# Altium project controlhub.PrjPCB
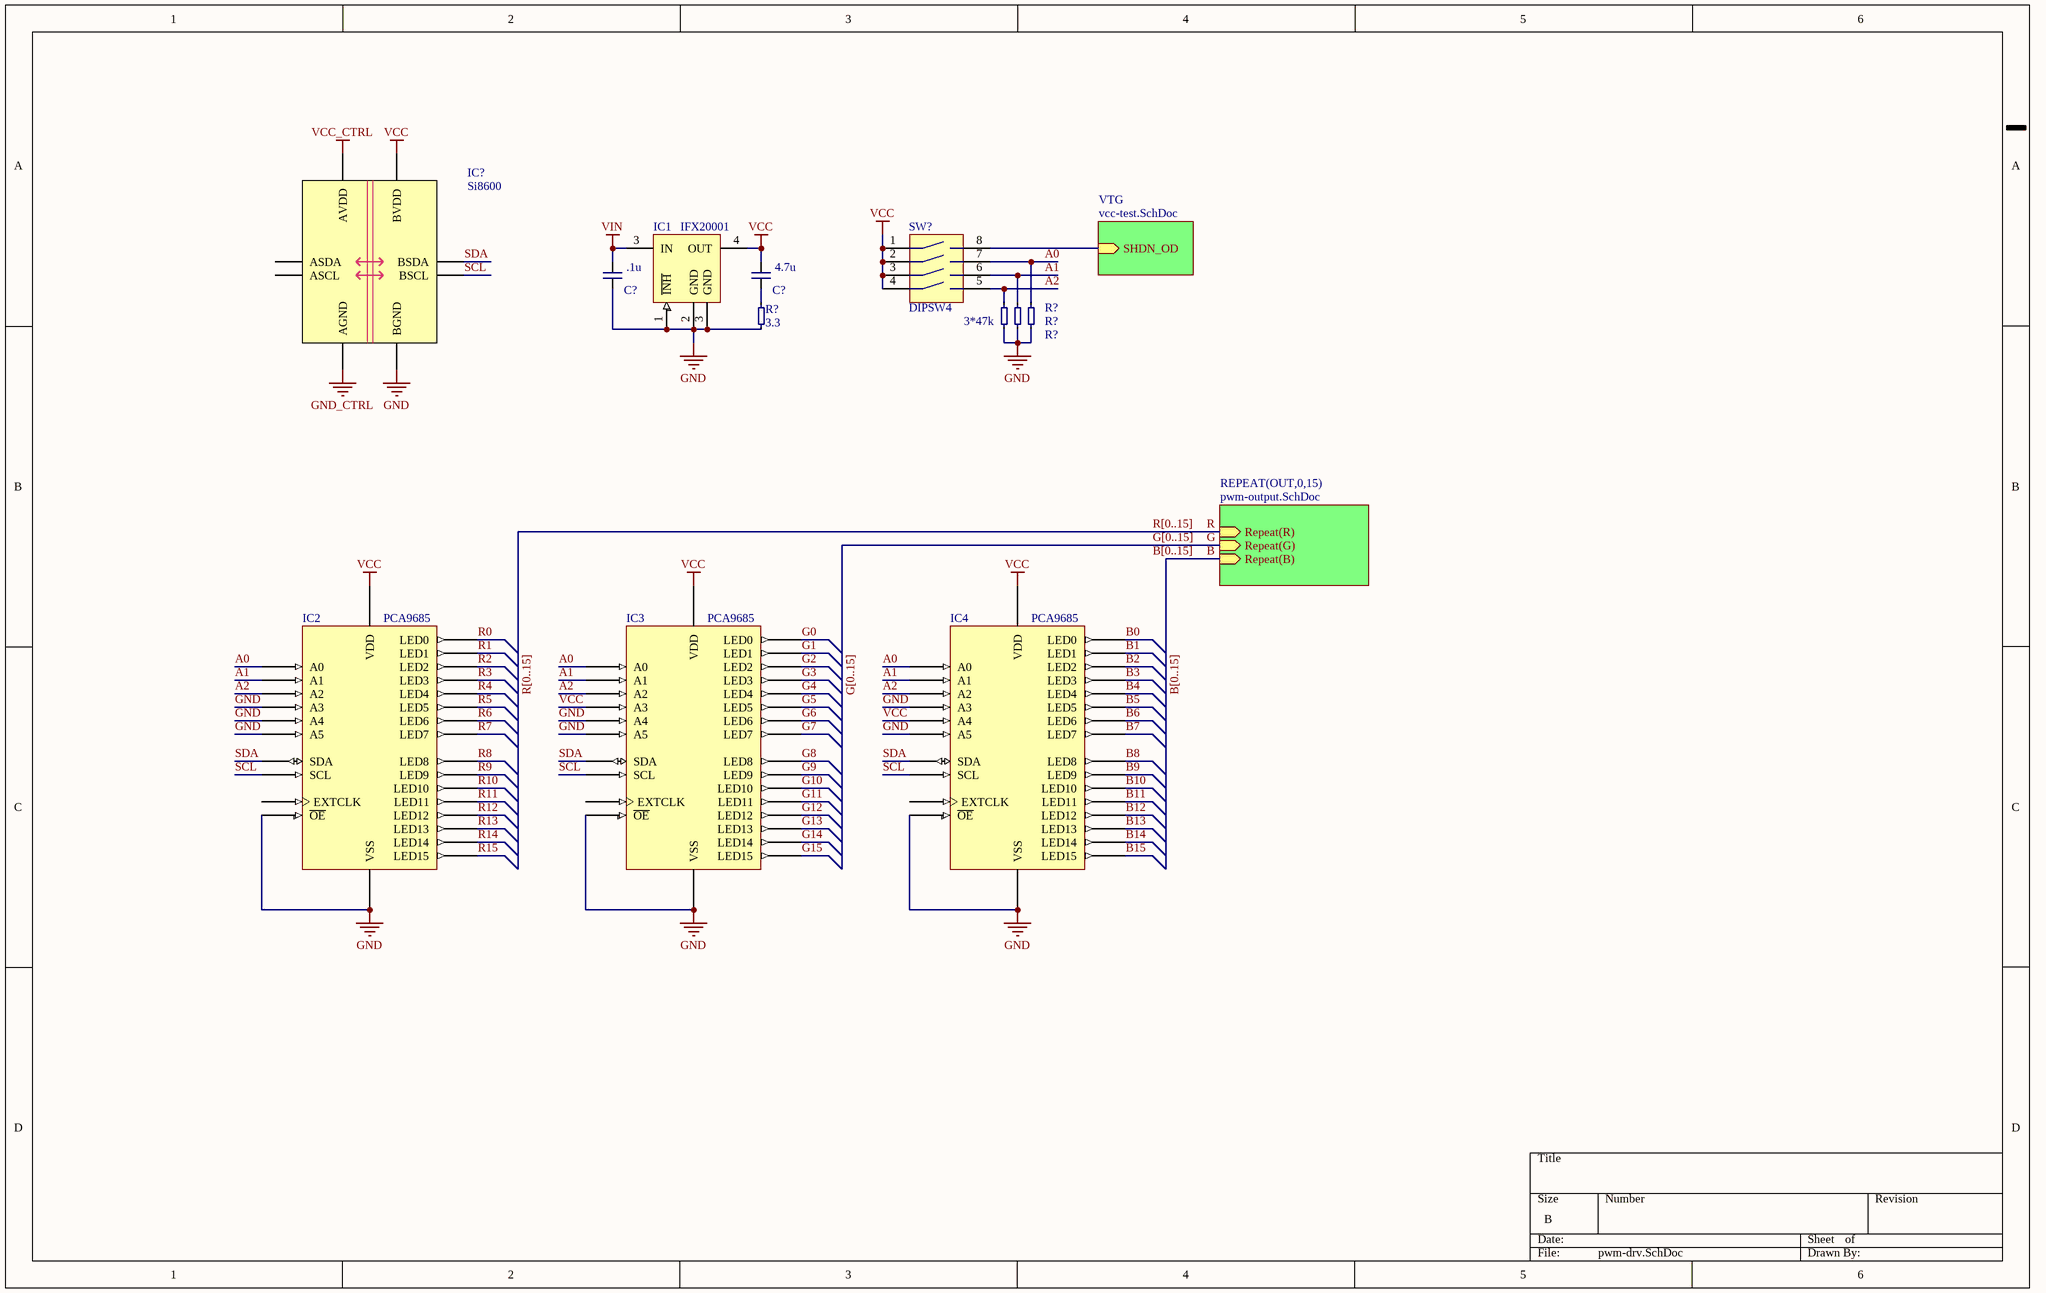
[diagram p0: pwm-drv.SchDoc]
3 sheets, 180 parts. Net scope: hierarchical (ports join the sheet entries above them; power ports are global).
Board file: pwm-drv.PcbDoc
Sheets:
  pwm-drv.SchDoc
    OUT0 = pwm-output.SchDoc
    OUT1 = pwm-output.SchDoc
    OUT2 = pwm-output.SchDoc
    OUT3 = pwm-output.SchDoc
    OUT4 = pwm-output.SchDoc
    OUT5 = pwm-output.SchDoc
    OUT6 = pwm-output.SchDoc
    OUT7 = pwm-output.SchDoc
    OUT8 = pwm-output.SchDoc
    OUT9 = pwm-output.SchDoc
    OUT10 = pwm-output.SchDoc
    OUT11 = pwm-output.SchDoc
    OUT12 = pwm-output.SchDoc
    OUT13 = pwm-output.SchDoc
    OUT14 = pwm-output.SchDoc
    OUT15 = pwm-output.SchDoc
    VTG = vcc-test.SchDoc

## Sheet pwm-drv.SchDoc
size B

### Parts
(Parts that share a designator on the sheet are numbered #1, #2 ... from top to bottom, then left to right.)
C?#1  .1u
C?#2  4.7u
IC1  IFX20001  [PG-SCT595-5]
IC2  PCA9685  [TSSOP28]
IC3  PCA9685  [TSSOP28]
IC4  PCA9685  [TSSOP28]
IC?#1  Si8600  [SO-8]
R?#1  3.3
R?#2  47k  (value not drawn)
R?#3  47k  (value not drawn)
R?#4  47k  (value not drawn)
SW?  DIPSW4  [DIPSW4]

### Sub-sheets
REPEAT(OUT,0,15) = pwm-output.SchDoc: Repeat(R) (in), Repeat(G) (in), Repeat(B) (in)
VTG = vcc-test.SchDoc: SHDN_OD (in)

### Nets
GND: C?#1.2 IC1.1(~{INH}) IC1.2(GND) IC1.3(GND) IC2.4(A3) IC2.5(A4) IC2.14(VSS) IC2.23(~{OE}) IC2.24(A5) IC3.5(A4) IC3.14(VSS) IC3.23(~{OE}) IC3.24(A5) IC4.4(A3) IC4.14(VSS) IC4.23(~{OE}) IC4.24(A5) IC?#1.5(BGND) R?#1.2 R?#2.2 R?#3.2 R?#4.2
GND_CTRL: IC?#1.4(AGND)
VCC: C?#2.1 IC1.4(OUT) IC2.28(VDD) IC3.4(A3) IC3.28(VDD) IC4.5(A4) IC4.28(VDD) IC?#1.8(BVDD) SW?.1 SW?.2 SW?.3 SW?.4
VCC_CTRL: IC?#1.1(AVDD)
VIN: C?#1.1 IC1.3(IN)
A0: IC2.1(A0) IC3.1(A0) IC4.1(A0) R?#4.1 SW?.7
A1: IC2.2(A1) IC3.2(A1) IC4.2(A1) R?#3.1 SW?.6
A2: IC2.3(A2) IC3.3(A2) IC4.3(A2) R?#2.1 SW?.5
B: sheet REPEAT(OUT,0,15)/Repeat(B)
B0: IC4.6(LED0)
B1: IC4.7(LED1)
B2: IC4.8(LED2)
B3: IC4.9(LED3)
B4: IC4.10(LED4)
B5: IC4.11(LED5)
B6: IC4.12(LED6)
B7: IC4.13(LED7)
B8: IC4.15(LED8)
B9: IC4.16(LED9)
B10: IC4.17(LED10)
B11: IC4.18(LED11)
B12: IC4.19(LED12)
B13: IC4.20(LED13)
B14: IC4.21(LED14)
B15: IC4.22(LED15)
G: sheet REPEAT(OUT,0,15)/Repeat(G)
G0: IC3.6(LED0)
G1: IC3.7(LED1)
G2: IC3.8(LED2)
G3: IC3.9(LED3)
G4: IC3.10(LED4)
G5: IC3.11(LED5)
G6: IC3.12(LED6)
G7: IC3.13(LED7)
G8: IC3.15(LED8)
G9: IC3.16(LED9)
G10: IC3.17(LED10)
G11: IC3.18(LED11)
G12: IC3.19(LED12)
G13: IC3.20(LED13)
G14: IC3.21(LED14)
G15: IC3.22(LED15)
R: sheet REPEAT(OUT,0,15)/Repeat(R)
R0: IC2.6(LED0)
R1: IC2.7(LED1)
R2: IC2.8(LED2)
R3: IC2.9(LED3)
R4: IC2.10(LED4)
R5: IC2.11(LED5)
R6: IC2.12(LED6)
R7: IC2.13(LED7)
R8: IC2.15(LED8)
R9: IC2.16(LED9)
R10: IC2.17(LED10)
R11: IC2.18(LED11)
R12: IC2.19(LED12)
R13: IC2.20(LED13)
R14: IC2.21(LED14)
R15: IC2.22(LED15)
SCL: IC2.26(SCL) IC3.26(SCL) IC4.26(SCL) IC?#1.6(BSCL)
SDA: IC2.27(SDA) IC3.27(SDA) IC4.27(SDA) IC?#1.7(BSDA)
NetC?#2_2: C?#2.2 R?#1.1
NetIC?#2_5: SW?.8 ; sheet VTG/SHDN_OD

Not connected (* = marked no-connect by the designer): IC2 25(EXTCLK); IC3 25(EXTCLK); IC4 25(EXTCLK); IC?#1 2(ASDA) 3(ASCL)

### Buses and harness runs
bus B[0..15]
bus G[0..15]
bus R[0..15]

### Notes on the sheet
- (near R?#2) 3*47k
- Labels drawn without touching a wire or pin: B[0..15]

### Library data of the parts
C?#1 C?#2 = Cap
IC1 = IFX20001: LDO 40V 30mA
IC2-IC4 = PCA9685: 16ch 12-bit I2C PWM Controller
IC?#1 = Si8600: Bidirectional I2C Isolator
R?#1-R?#4 = Res
SW? = DIPSW4: DIP-switch 4 pole

## Sheet pwm-output.SchDoc
size A
Used 16 times, as channels OUT0, OUT1, OUT2, OUT3, OUT4, OUT5, OUT6, OUT7, OUT8, OUT9, OUT10, OUT11, OUT12, OUT13, OUT14, OUT15. Parts and nets are listed once, with the designators drawn on the sheet.
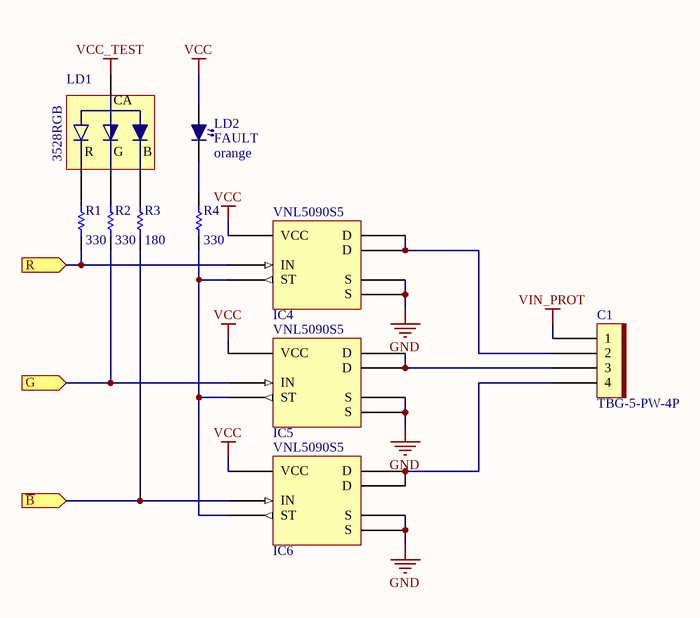
[diagram p1: pwm-output.SchDoc]

### Parts
C1  TBG-5-PW-4P  [TBG-5-PW-4P]
IC4  VNL5090S5  [SO-8]
IC5  VNL5090S5  [SO-8]
IC6  VNL5090S5  [SO-8]
LD1  3528RGB  [PLCC3528]
LD2  FAULT  color: orange
R1  value 330  [AXIAL-0.3]
R2  value 330  [AXIAL-0.3]
R3  value 180  [AXIAL-0.3]
R4  value 330  [AXIAL-0.3]

### Ports
G (in), R (in), ~{B} (in)

### Nets
GND: IC4.6(S) IC4.7(S) IC5.6(S) IC5.7(S) IC6.6(S) IC6.7(S)
VCC: IC4.1(VCC) IC5.1(VCC) IC6.1(VCC) LD2.A
VCC_TEST: LD1.1(A)
VIN_PROT: C1.1
~{B}: IC6.2(IN) R3.1 ; port ~{B}
G: IC5.2(IN) R2.1 ; port G
R: IC4.2(IN) R1.1 ; port R
NetC1_2: C1.2 IC4.5(D) IC4.8(D)
NetC1_3: C1.3 IC5.5(D) IC5.8(D)
NetC1_4: C1.4 IC6.5(D) IC6.8(D)
NetIC4_3: IC4.3(ST) IC5.3(ST) IC6.3(ST) R4.1
NetLD1_2: LD1.2(KR) R1.2
NetLD1_3: LD1.3(KB) R3.2
NetLD1_4: LD1.4(KG) R2.2
NetLD2_K: LD2.K R4.2

### Channels
OUT0: designators end in _OUT0; ports G=G0 R=R0 ~{B}=NetIC6_OUT0_2
OUT1: designators end in _OUT1; ports G=G1 R=R1 ~{B}=NetIC6_OUT1_2
OUT2: designators end in _OUT2; ports G=G2 R=R2 ~{B}=NetIC6_OUT2_2
OUT3: designators end in _OUT3; ports G=G3 R=R3 ~{B}=NetIC6_OUT3_2
OUT4: designators end in _OUT4; ports G=G4 R=R4 ~{B}=NetIC6_OUT4_2
OUT5: designators end in _OUT5; ports G=G5 R=R5 ~{B}=NetIC6_OUT5_2
OUT6: designators end in _OUT6; ports G=G6 R=R6 ~{B}=NetIC6_OUT6_2
OUT7: designators end in _OUT7; ports G=G7 R=R7 ~{B}=NetIC6_OUT7_2
OUT8: designators end in _OUT8; ports G=G8 R=R8 ~{B}=NetIC6_OUT8_2
OUT9: designators end in _OUT9; ports G=G9 R=R9 ~{B}=NetIC6_OUT9_2
OUT10: designators end in _OUT10; ports G=G10 R=R10 ~{B}=NetIC6_OUT10_2
OUT11: designators end in _OUT11; ports G=G11 R=R11 ~{B}=NetIC6_OUT11_2
OUT12: designators end in _OUT12; ports G=G12 R=R12 ~{B}=NetIC6_OUT12_2
OUT13: designators end in _OUT13; ports G=G13 R=R13 ~{B}=NetIC6_OUT13_2
OUT14: designators end in _OUT14; ports G=G14 R=R14 ~{B}=NetIC6_OUT14_2
OUT15: designators end in _OUT15; ports G=G15 R=R15 ~{B}=NetIC6_OUT15_2

### Notes on the sheet
- (in symbol 3528RGB) CA; R; G; B

### Library data of the parts
C1 = TBG-5-PW-4P: Pluggable socket header
IC4-IC6 = VNL5090S5: Protected 13A low-side driver
LD1 = 3528RGB: 3528 RGB LED
LD2 = LED
R1-R4 = Res1

## Sheet vcc-test.SchDoc
size A
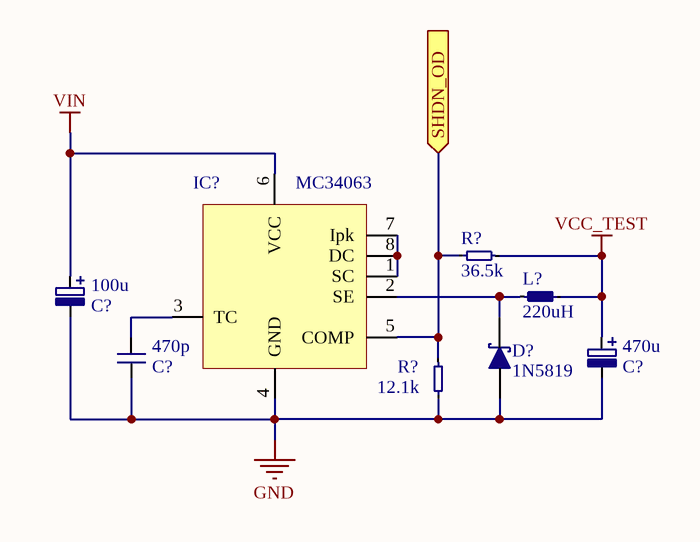
[diagram p2: vcc-test.SchDoc]

### Parts
(Parts that share a designator on the sheet are numbered #1, #2 ... from top to bottom, then left to right.)
C?#3  100u
C?#4  470p
C?#5  470u
D?  1N5819
IC?#2  MC34063  [SO-8]
L?  220uH
R?#5  36.5k
R?#6  12.1k

### Ports
SHDN_OD (in)

### Nets
GND: C?#3.2 C?#4.2 C?#5.2 D?.A IC?#2.4(GND) R?#6.2
VCC_TEST: C?#5.1 L?.2 R?#5.1
VIN: C?#3.1 IC?#2.6(VCC)
NetC?#4_1: C?#4.1 IC?#2.3(TC)
NetD?_K: D?.K IC?#2.2(SE) L?.1
NetIC?#2_1: IC?#2.1(SC) IC?#2.7(Ipk) IC?#2.8(DC)
NetIC?#2_5: IC?#2.5(COMP) R?#5.2 R?#6.1 ; port SHDN_OD

### Library data of the parts
C?#3 C?#5 = Cap_El
C?#4 = Cap
D? = Schottky: Schottky Diode
L? = Inductor
R?#5 R?#6 = Res

## Nets that join several sheets
GND: pwm-drv (22 pins), OUT0 (6 pins), OUT1 (6 pins), OUT2 (6 pins), OUT3 (6 pins), OUT4 (6 pins), OUT5 (6 pins), OUT6 (6 pins), OUT7 (6 pins), OUT8 (6 pins), OUT9 (6 pins), OUT10 (6 pins), OUT11 (6 pins), OUT12 (6 pins), OUT13 (6 pins), OUT14 (6 pins), OUT15 (6 pins), vcc-test (6 pins)
VCC: pwm-drv (12 pins), OUT0 (IC4_OUT0.1 IC5_OUT0.1 IC6_OUT0.1 LD2_OUT0.A), OUT1 (IC4_OUT1.1 IC5_OUT1.1 IC6_OUT1.1 LD2_OUT1.A), OUT2 (IC4_OUT2.1 IC5_OUT2.1 IC6_OUT2.1 LD2_OUT2.A), OUT3 (IC4_OUT3.1 IC5_OUT3.1 IC6_OUT3.1 LD2_OUT3.A), OUT4 (IC4_OUT4.1 IC5_OUT4.1 IC6_OUT4.1 LD2_OUT4.A), OUT5 (IC4_OUT5.1 IC5_OUT5.1 IC6_OUT5.1 LD2_OUT5.A), OUT6 (IC4_OUT6.1 IC5_OUT6.1 IC6_OUT6.1 LD2_OUT6.A), OUT7 (IC4_OUT7.1 IC5_OUT7.1 IC6_OUT7.1 LD2_OUT7.A), OUT8 (IC4_OUT8.1 IC5_OUT8.1 IC6_OUT8.1 LD2_OUT8.A), OUT9 (IC4_OUT9.1 IC5_OUT9.1 IC6_OUT9.1 LD2_OUT9.A), OUT10 (IC4_OUT10.1 IC5_OUT10.1 IC6_OUT10.1 LD2_OUT10.A), OUT11 (IC4_OUT11.1 IC5_OUT11.1 IC6_OUT11.1 LD2_OUT11.A), OUT12 (IC4_OUT12.1 IC5_OUT12.1 IC6_OUT12.1 LD2_OUT12.A), OUT13 (IC4_OUT13.1 IC5_OUT13.1 IC6_OUT13.1 LD2_OUT13.A), OUT14 (IC4_OUT14.1 IC5_OUT14.1 IC6_OUT14.1 LD2_OUT14.A), OUT15 (IC4_OUT15.1 IC5_OUT15.1 IC6_OUT15.1 LD2_OUT15.A)
VCC_TEST: OUT0 (LD1_OUT0.1), OUT1 (LD1_OUT1.1), OUT2 (LD1_OUT2.1), OUT3 (LD1_OUT3.1), OUT4 (LD1_OUT4.1), OUT5 (LD1_OUT5.1), OUT6 (LD1_OUT6.1), OUT7 (LD1_OUT7.1), OUT8 (LD1_OUT8.1), OUT9 (LD1_OUT9.1), OUT10 (LD1_OUT10.1), OUT11 (LD1_OUT11.1), OUT12 (LD1_OUT12.1), OUT13 (LD1_OUT13.1), OUT14 (LD1_OUT14.1), OUT15 (LD1_OUT15.1), vcc-test (C?#5.1 L?.2 R?#5.1)
VIN: pwm-drv (C?#1.1 IC1.3), vcc-test (C?#3.1 IC?#2.6)
VIN_PROT: OUT0 (C1_OUT0.1), OUT1 (C1_OUT1.1), OUT2 (C1_OUT2.1), OUT3 (C1_OUT3.1), OUT4 (C1_OUT4.1), OUT5 (C1_OUT5.1), OUT6 (C1_OUT6.1), OUT7 (C1_OUT7.1), OUT8 (C1_OUT8.1), OUT9 (C1_OUT9.1), OUT10 (C1_OUT10.1), OUT11 (C1_OUT11.1), OUT12 (C1_OUT12.1), OUT13 (C1_OUT13.1), OUT14 (C1_OUT14.1), OUT15 (C1_OUT15.1)
G0: pwm-drv (IC3.6), OUT0 (IC5_OUT0.2 R2_OUT0.1)
G1: pwm-drv (IC3.7), OUT1 (IC5_OUT1.2 R2_OUT1.1)
G2: pwm-drv (IC3.8), OUT2 (IC5_OUT2.2 R2_OUT2.1)
G3: pwm-drv (IC3.9), OUT3 (IC5_OUT3.2 R2_OUT3.1)
G4: pwm-drv (IC3.10), OUT4 (IC5_OUT4.2 R2_OUT4.1)
G5: pwm-drv (IC3.11), OUT5 (IC5_OUT5.2 R2_OUT5.1)
G6: pwm-drv (IC3.12), OUT6 (IC5_OUT6.2 R2_OUT6.1)
G7: pwm-drv (IC3.13), OUT7 (IC5_OUT7.2 R2_OUT7.1)
G8: pwm-drv (IC3.15), OUT8 (IC5_OUT8.2 R2_OUT8.1)
G9: pwm-drv (IC3.16), OUT9 (IC5_OUT9.2 R2_OUT9.1)
G10: pwm-drv (IC3.17), OUT10 (IC5_OUT10.2 R2_OUT10.1)
G11: pwm-drv (IC3.18), OUT11 (IC5_OUT11.2 R2_OUT11.1)
G12: pwm-drv (IC3.19), OUT12 (IC5_OUT12.2 R2_OUT12.1)
G13: pwm-drv (IC3.20), OUT13 (IC5_OUT13.2 R2_OUT13.1)
G14: pwm-drv (IC3.21), OUT14 (IC5_OUT14.2 R2_OUT14.1)
G15: pwm-drv (IC3.22), OUT15 (IC5_OUT15.2 R2_OUT15.1)
NetIC?#2_5: pwm-drv (SW?.8), vcc-test (IC?#2.5 R?#5.2 R?#6.1)
R0: pwm-drv (IC2.6), OUT0 (IC4_OUT0.2 R1_OUT0.1)
R1: pwm-drv (IC2.7), OUT1 (IC4_OUT1.2 R1_OUT1.1)
R2: pwm-drv (IC2.8), OUT2 (IC4_OUT2.2 R1_OUT2.1)
R3: pwm-drv (IC2.9), OUT3 (IC4_OUT3.2 R1_OUT3.1)
R4: pwm-drv (IC2.10), OUT4 (IC4_OUT4.2 R1_OUT4.1)
R5: pwm-drv (IC2.11), OUT5 (IC4_OUT5.2 R1_OUT5.1)
R6: pwm-drv (IC2.12), OUT6 (IC4_OUT6.2 R1_OUT6.1)
R7: pwm-drv (IC2.13), OUT7 (IC4_OUT7.2 R1_OUT7.1)
R8: pwm-drv (IC2.15), OUT8 (IC4_OUT8.2 R1_OUT8.1)
R9: pwm-drv (IC2.16), OUT9 (IC4_OUT9.2 R1_OUT9.1)
R10: pwm-drv (IC2.17), OUT10 (IC4_OUT10.2 R1_OUT10.1)
R11: pwm-drv (IC2.18), OUT11 (IC4_OUT11.2 R1_OUT11.1)
R12: pwm-drv (IC2.19), OUT12 (IC4_OUT12.2 R1_OUT12.1)
R13: pwm-drv (IC2.20), OUT13 (IC4_OUT13.2 R1_OUT13.1)
R14: pwm-drv (IC2.21), OUT14 (IC4_OUT14.2 R1_OUT14.1)
R15: pwm-drv (IC2.22), OUT15 (IC4_OUT15.2 R1_OUT15.1)